# EAGLE design mma7260+tinybreakout (EAGLE 6.1)
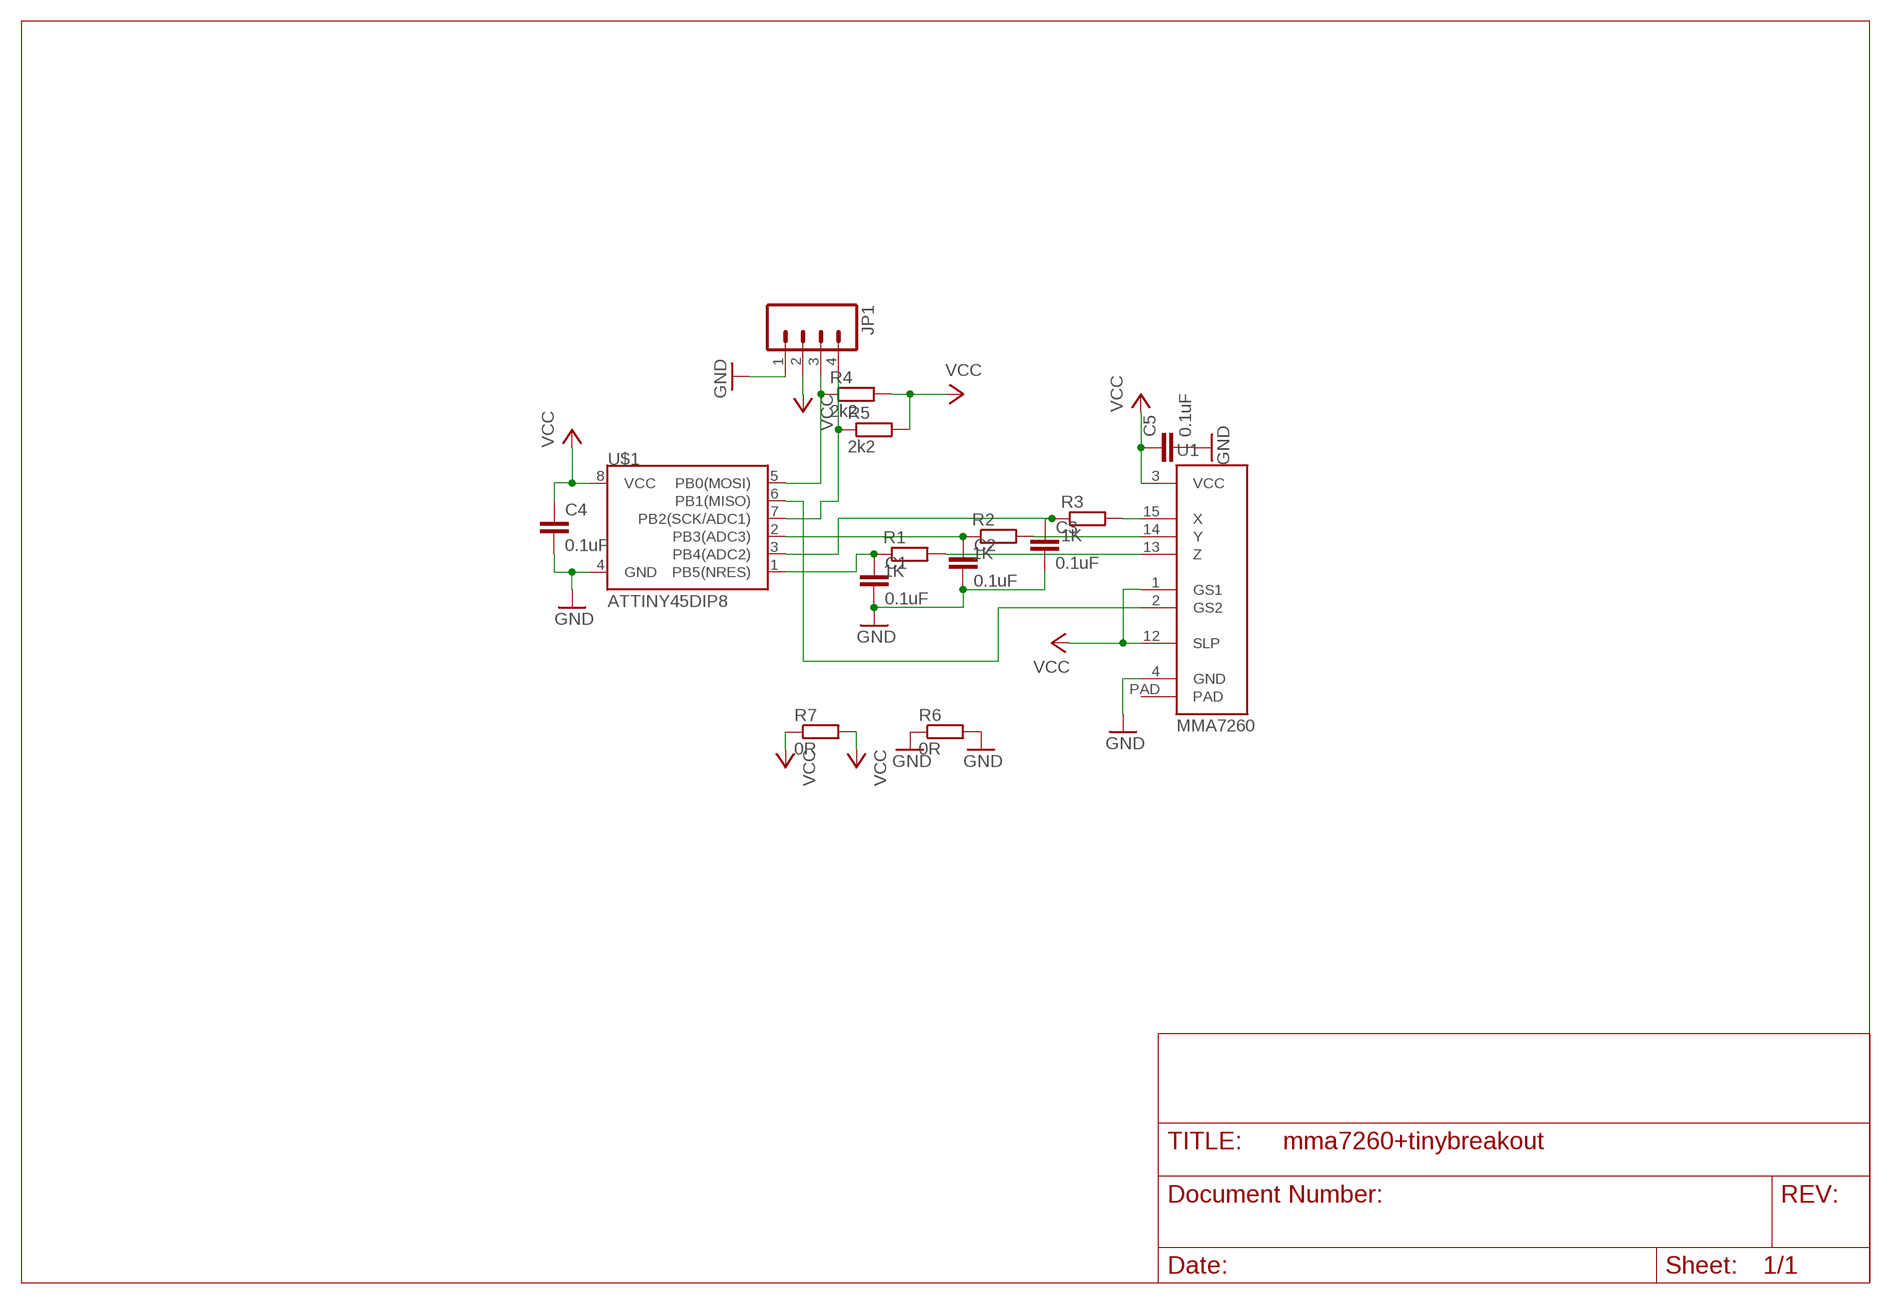
[diagram p0: schematic, sheet 1]

## Parts
C1  0.1uF  C-EUC1206  [C1206]
C2  0.1uF  C-EUC1206  [C1206]
C3  0.1uF  C-EUC1206  [C1206]
C4  0.1uF  C-EUC1206  [C1206]
C5  0.1uF  C-EUC1206  [C1206]
JP1  M04LOCK  [1X04_LOCK]
R1  1K  R-EU_R0805  [R0805]
R2  1K  R-EU_R0805  [R0805]
R3  1K  R-EU_R0805  [R0805]
R4  2k2  R-EU_R0805  [R0805]
R5  2k2  R-EU_R0805  [R0805]
R6  0R  R-EU_R1206  [R1206]
R7  0R  R-EU_R1206  [R1206]
U1  MMA7260  [MMA7260]
U$1  ATTINY45DIP8  [DIP08]

## Nets
GND: C1.2 C2.2 C3.2 C4.2 C5.2 JP1.1 R6.1 R6.2 U1.4(GND) U$1.4(GND)
N$1: R1.2 U1.13(Z)
N$2: R2.2 U1.14(Y)
N$3: R3.2 U1.15(X)
N$4: C3.1 R3.1 U$1.3(PB4(ADC2))
N$5: C2.1 R2.1 U$1.2(PB3(ADC3))
N$6: JP1.4 R5.1 U$1.7(PB2(SCK/ADC1))
N$7: U1.2(GS2) U$1.6(PB1(MISO))
N$8: C1.1 R1.1 U$1.1(PB5(NRES))
N$9: JP1.3 R4.1 U$1.5(PB0(MOSI))
VCC: C4.1 C5.1 JP1.2 R4.2 R5.2 R7.1 R7.2 U1.1(GS1) U1.3(VCC) U1.12(SLP) U$1.8(VCC)
Unconnected: U1.PAD

## Library data of the parts
C1-C5 = resistor:C-EU: CAPACITOR, European symbol
JP1 = SparkFun:M04: Header 4 Standard 4-pin 0.1" header. Use with straight break away headers (SKU : PRT-00116), right angle break away headers (PRT-00553), swiss pins (PRT-00743), machine pins (PRT-00117), and female headers (PRT-00115). Molex polarized connector foot print use with SKU : PRT-08231 with associated crimp pins and housings.
R1-R7 = resistor:R-EU_: RESISTOR, European symbol
U1 = SparkFun:MMA7260: MMA7260Q Triple axis accelerometer from Freescale. Schematic element and footprint production proven. Center pad has reduced paste layer for solder short reduction. Spark Fun Electronics SKU : COM-00308
U$1 = SparkFun:ATTINY45: Atmel ATTiny45

## Board
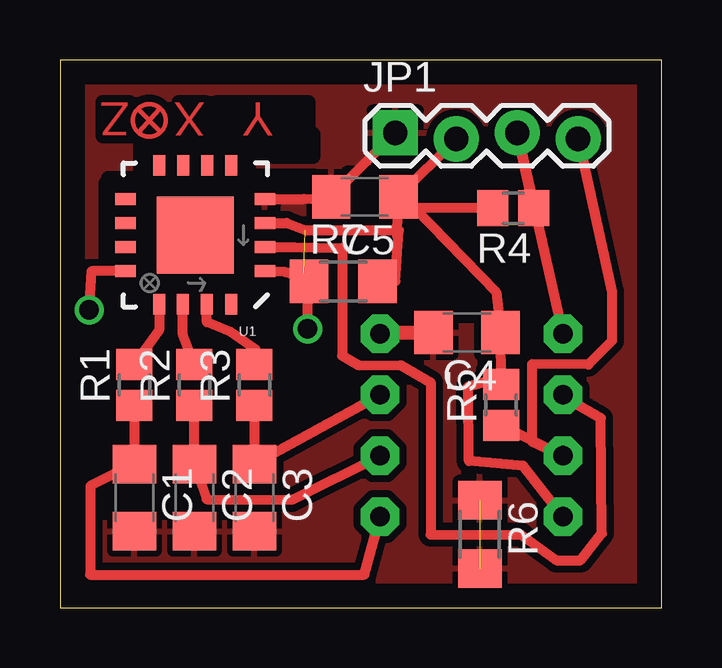
[diagram p1: board, top side]
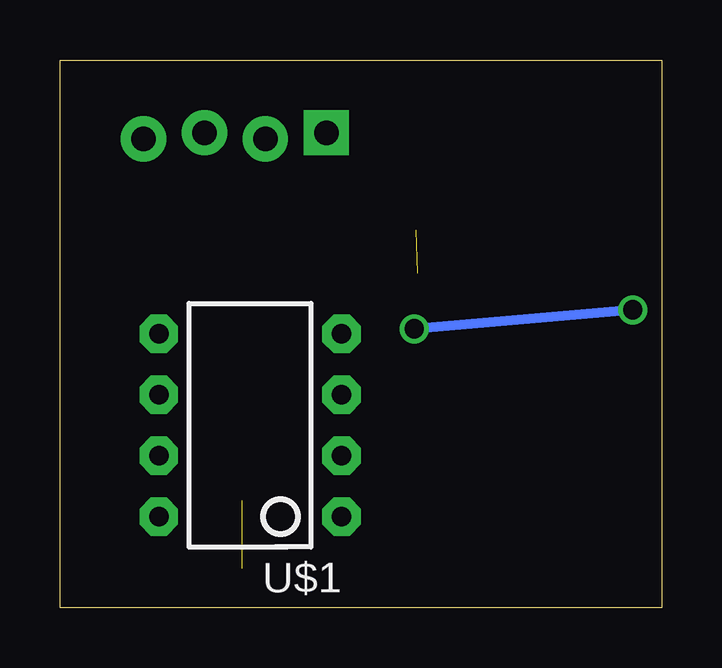
[diagram p2: board, bottom side, seen from below]

Size 25.07 x 22.85 mm. Coordinates in mm from the lower left corner, seen from the top.
Outline: 0,0 25.07,0 25.07,22.85 0,22.85 0,0
Copper layers (1*16): Top 0.035mm / dielectric 1.5mm / Bottom 0.035mm
Design rules: minimum track width 10mil, minimum drill 24mil, track to track 8mil, track to pad 8mil, pad to pad 8mil, via to via 8mil, smd to smd 8mil, copper to edge 40mil, drill to drill 8mil, minimum pad ring 10mil, minimum via ring 8mil, stop-mask expansion 4mil, vias tented up to drill 0mil, thermal gap 10mil
tRestrict: area 10.9,15.6 to 13.8,16.6; area 12,16.3 to 13.7,18.2; area 7.4,14.3 to 8,17.8; area 3.5,17.2 to 8,17.9; area 3.3,14.4 to 4,17.9; area 3.3,13.2 to 4,13.7; area 3.6,18.9 to 7.6,19.4; area 7.5,17.5 to 7.9,19.4; area 3.4,17.4 to 3.9,19.3; area 2,17.3 to 3.8,17.9; area 2,13.5 to 2.5,17.6; area 1.9,13.5 to 2.8,17.7; 8 more areas

### Footprints (pad centres in the part's own frame; a part is rotated, then mirrored left to right if it is on the bottom)
C1206 = smd 1.6 x 1.8: 1 -1.4,0; 2 1.4,0
1X04_LOCK = drill 1.016 pad 1.88 square: 1 0,0.127 | drill 1.016 pad 1.88: 2 2.54,-0.127; 3 5.08,0.127; 4 7.62,-0.127
R0805 = smd 1.3 x 1.5: 1 -0.85,0; 2 0.85,0
R1206 = smd 1.6 x 1.803: 1 -1.422,0; 2 1.422,0
MMA7260 = smd 0.855 x 0.5: 1 -2.902,1.5; 2 -2.902,0.5; 3 -2.902,-0.5; 4 -2.902,-1.5; 9 2.902,-1.5; 10 2.902,-0.5; 11 2.902,0.5; 12 2.902,1.5 | smd 0.5 x 0.855: 5 -1.5,-2.902; 6 -0.5,-2.902; 7 0.5,-2.902; 8 1.5,-2.902; 13 1.5,2.877; 14 0.525,2.877; 15 -0.475,2.877; 16 -1.5,2.877 | smd 3.2 x 3.2: PAD 0,0
DIP08 = drill 0.813 pad 1.6 octagon: 1 -3.81,-3.81; 2 -1.27,-3.81; 3 1.27,-3.81; 4 3.81,-3.81; 5 3.81,3.81; 6 1.27,3.81; 7 -1.27,3.81; 8 -3.81,3.81

### Placement (x,y rotation side)
C1  3.1,4.6 270 top
C2  5.6,4.6 270 top
C3  8.1,4.6 270 top
C4  16.96,11.49 180 top
C5  12.7,17.14 180 top
JP1  13.97,19.68 0 top
R1  3.1,9.3 90 top
R2  5.6,9.3 90 top
R3  8.1,9.3 90 top
R4  18.89,16.67 180 top
R5  18.38,8.47 90 top
R6  17.5,3.07 270 top
R7  11.8,13.62 0 top
U1  5.64,15.55 180 top
U$1  17.14,7.62 90 bottom

### Tracks (layer width: path | path; a pad name or v marks a point on that pad's centre or on a via)
GND  (1 unrouted)
  Top 0.254: 11.43,17.14 C5.2
  Top 0.406: U1.4 10.16,17.05 10.89,17.07 11.43,17.14 | JP1.1 C5.2 | 13.31,11.46 13.4,11.46 U$1.4
  Top 0.61: C4.2 13.4,11.46
  pour Top (isolate 0.305): -2.54,24.13 -2.54,-1.27 27.94,-1.27 29.21,-1.27 29.21,24.13
N$1
  Top 0.406: U1.13 4.13,11.59 R1.2
N$2
  Top 0.406: R2.2 5.12,11.39 U1.14
N$3
  Top 0.406: R3.2 8.15,10.78 7.11,11.51 6.12,11.92 U1.15
N$4
  Top 0.406: R3.1 C3.1 U$1.3
N$5
  Top 0.406: R2.1 C2.1 6.11,4.54 9.65,4.52 U$1.2
N$6
  Top 0.406: R5.1 U$1.7 19.66,6.94 19.67,10.17 22.02,10.15 23,11.14 22.99,13.19 JP1.4
N$7
  Top 0.406: U1.2 9.76,15.05 11.76,15.02 11.76,10.52 12.46,10.11 14.19,10.12 15.44,9.41 15.44,3.07 19.21,3.05 20.67,1.99 21.7,1.99 22.58,3.11 22.54,7.91 20.95,8.81 U$1.6
N$8
  Top 0.406: R1.1 C1.1 1.27,5.08 1.25,1.39 12.69,1.39 U$1.1
N$9
  Top 0.406: U$1.5 JP1.3 R4.1
N$12
  Top 0.19: 3.26,20.8 4.16,19.89
N$13
  Top 0.19: 4.14,20.81 3.28,19.84
VCC  (via drill 0.8)  (1 unrouted)
  Top 0.406: U1.3 9.45,16.05 10.23,15.75 14.12,15.75 | 14.12,15.75 14.05,15.52 14.08,16.51 | 14.08,16.51 C5.1 | JP1.2 C5.1 | C5.1 14.77,16.69 18.17,13.17 C4.1 R5.2 18.26,8.98 18.38,9.64 17.01,9.23 17.03,6.13 19.3,5.93 U$1.8 | R4.2 13.97,16.67 13.97,16.51 14.08,16.51 | R7.2 13.97,13.62 14.12,15.75 | 9.4,14 R7.1 10.36,13.7 10.34,13.73 v10.31,11.64 | 9.4,14 U1.1 | 9.4,14 10.16,13.97 10.4,13.7 | U1.12 1.32,14.04 v1.21,12.43
  Bottom 0.406: v1.21,12.43 v10.31,11.64
(copper drawn outside any net)
  shapes: Top circle x1

### Text on the board
Top: Z | X | ➞ | Y | ➞